# EAGLE design driver (EAGLE 9.6.2)
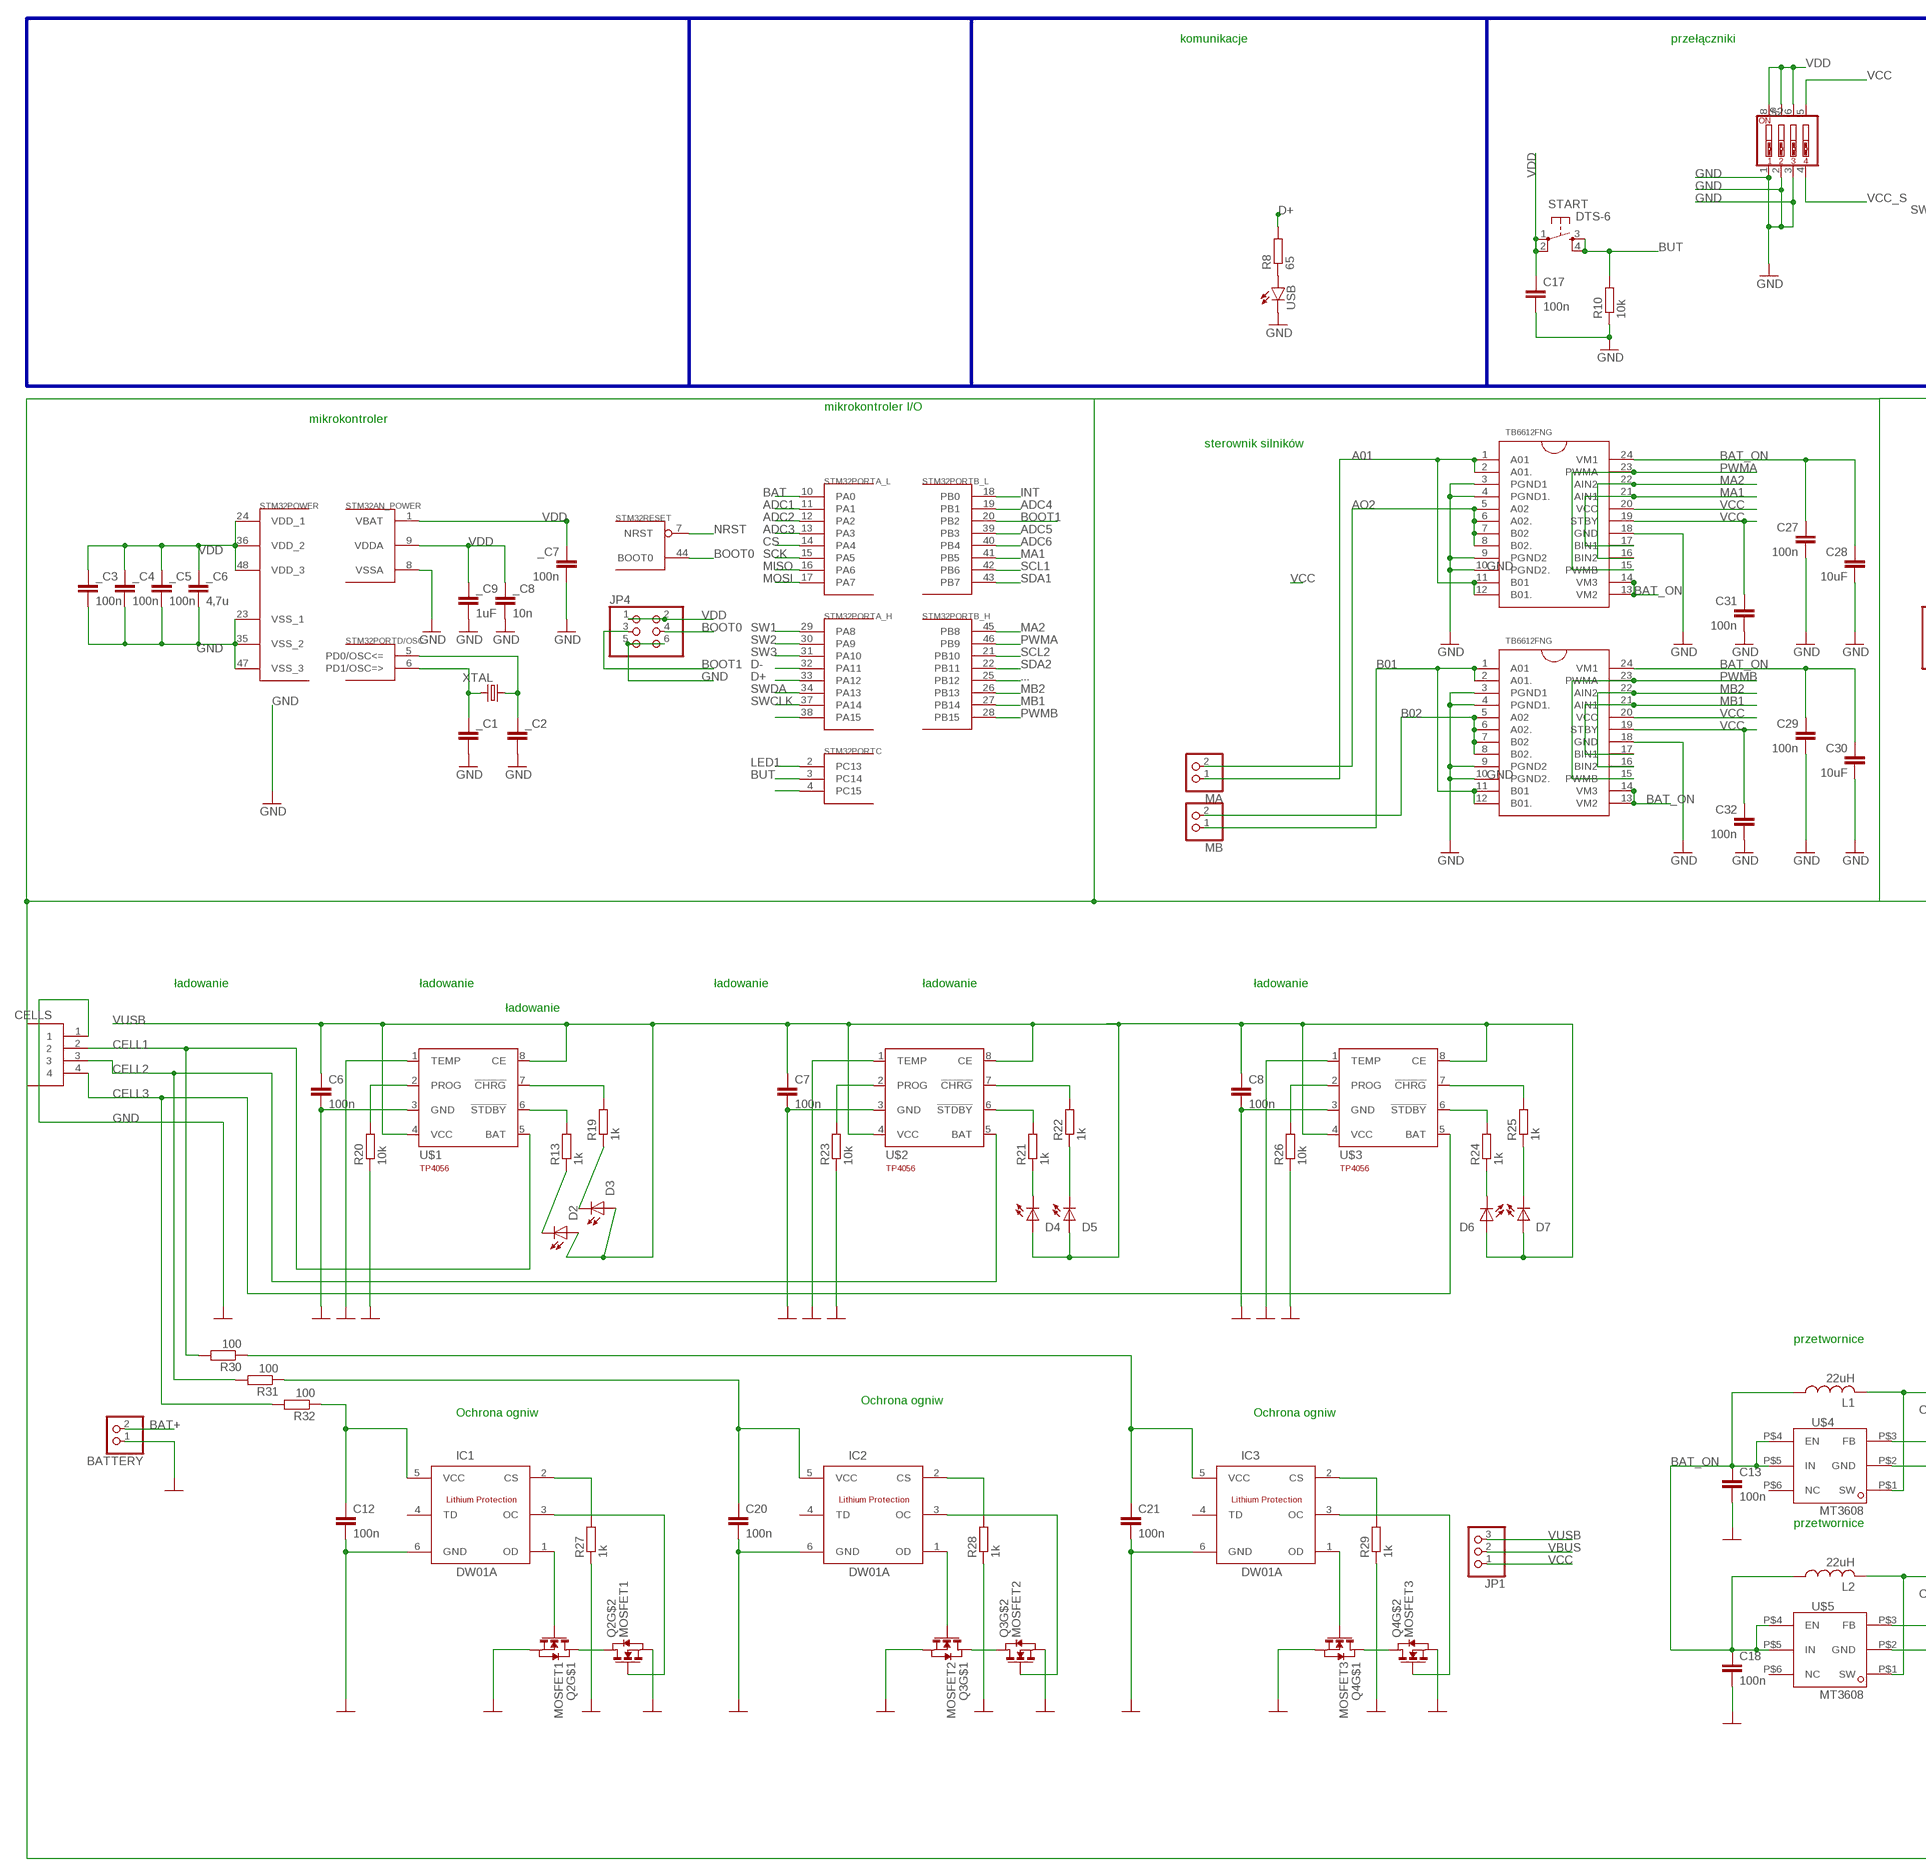
[diagram p0: schematic, sheet 1, part 1 of 2]
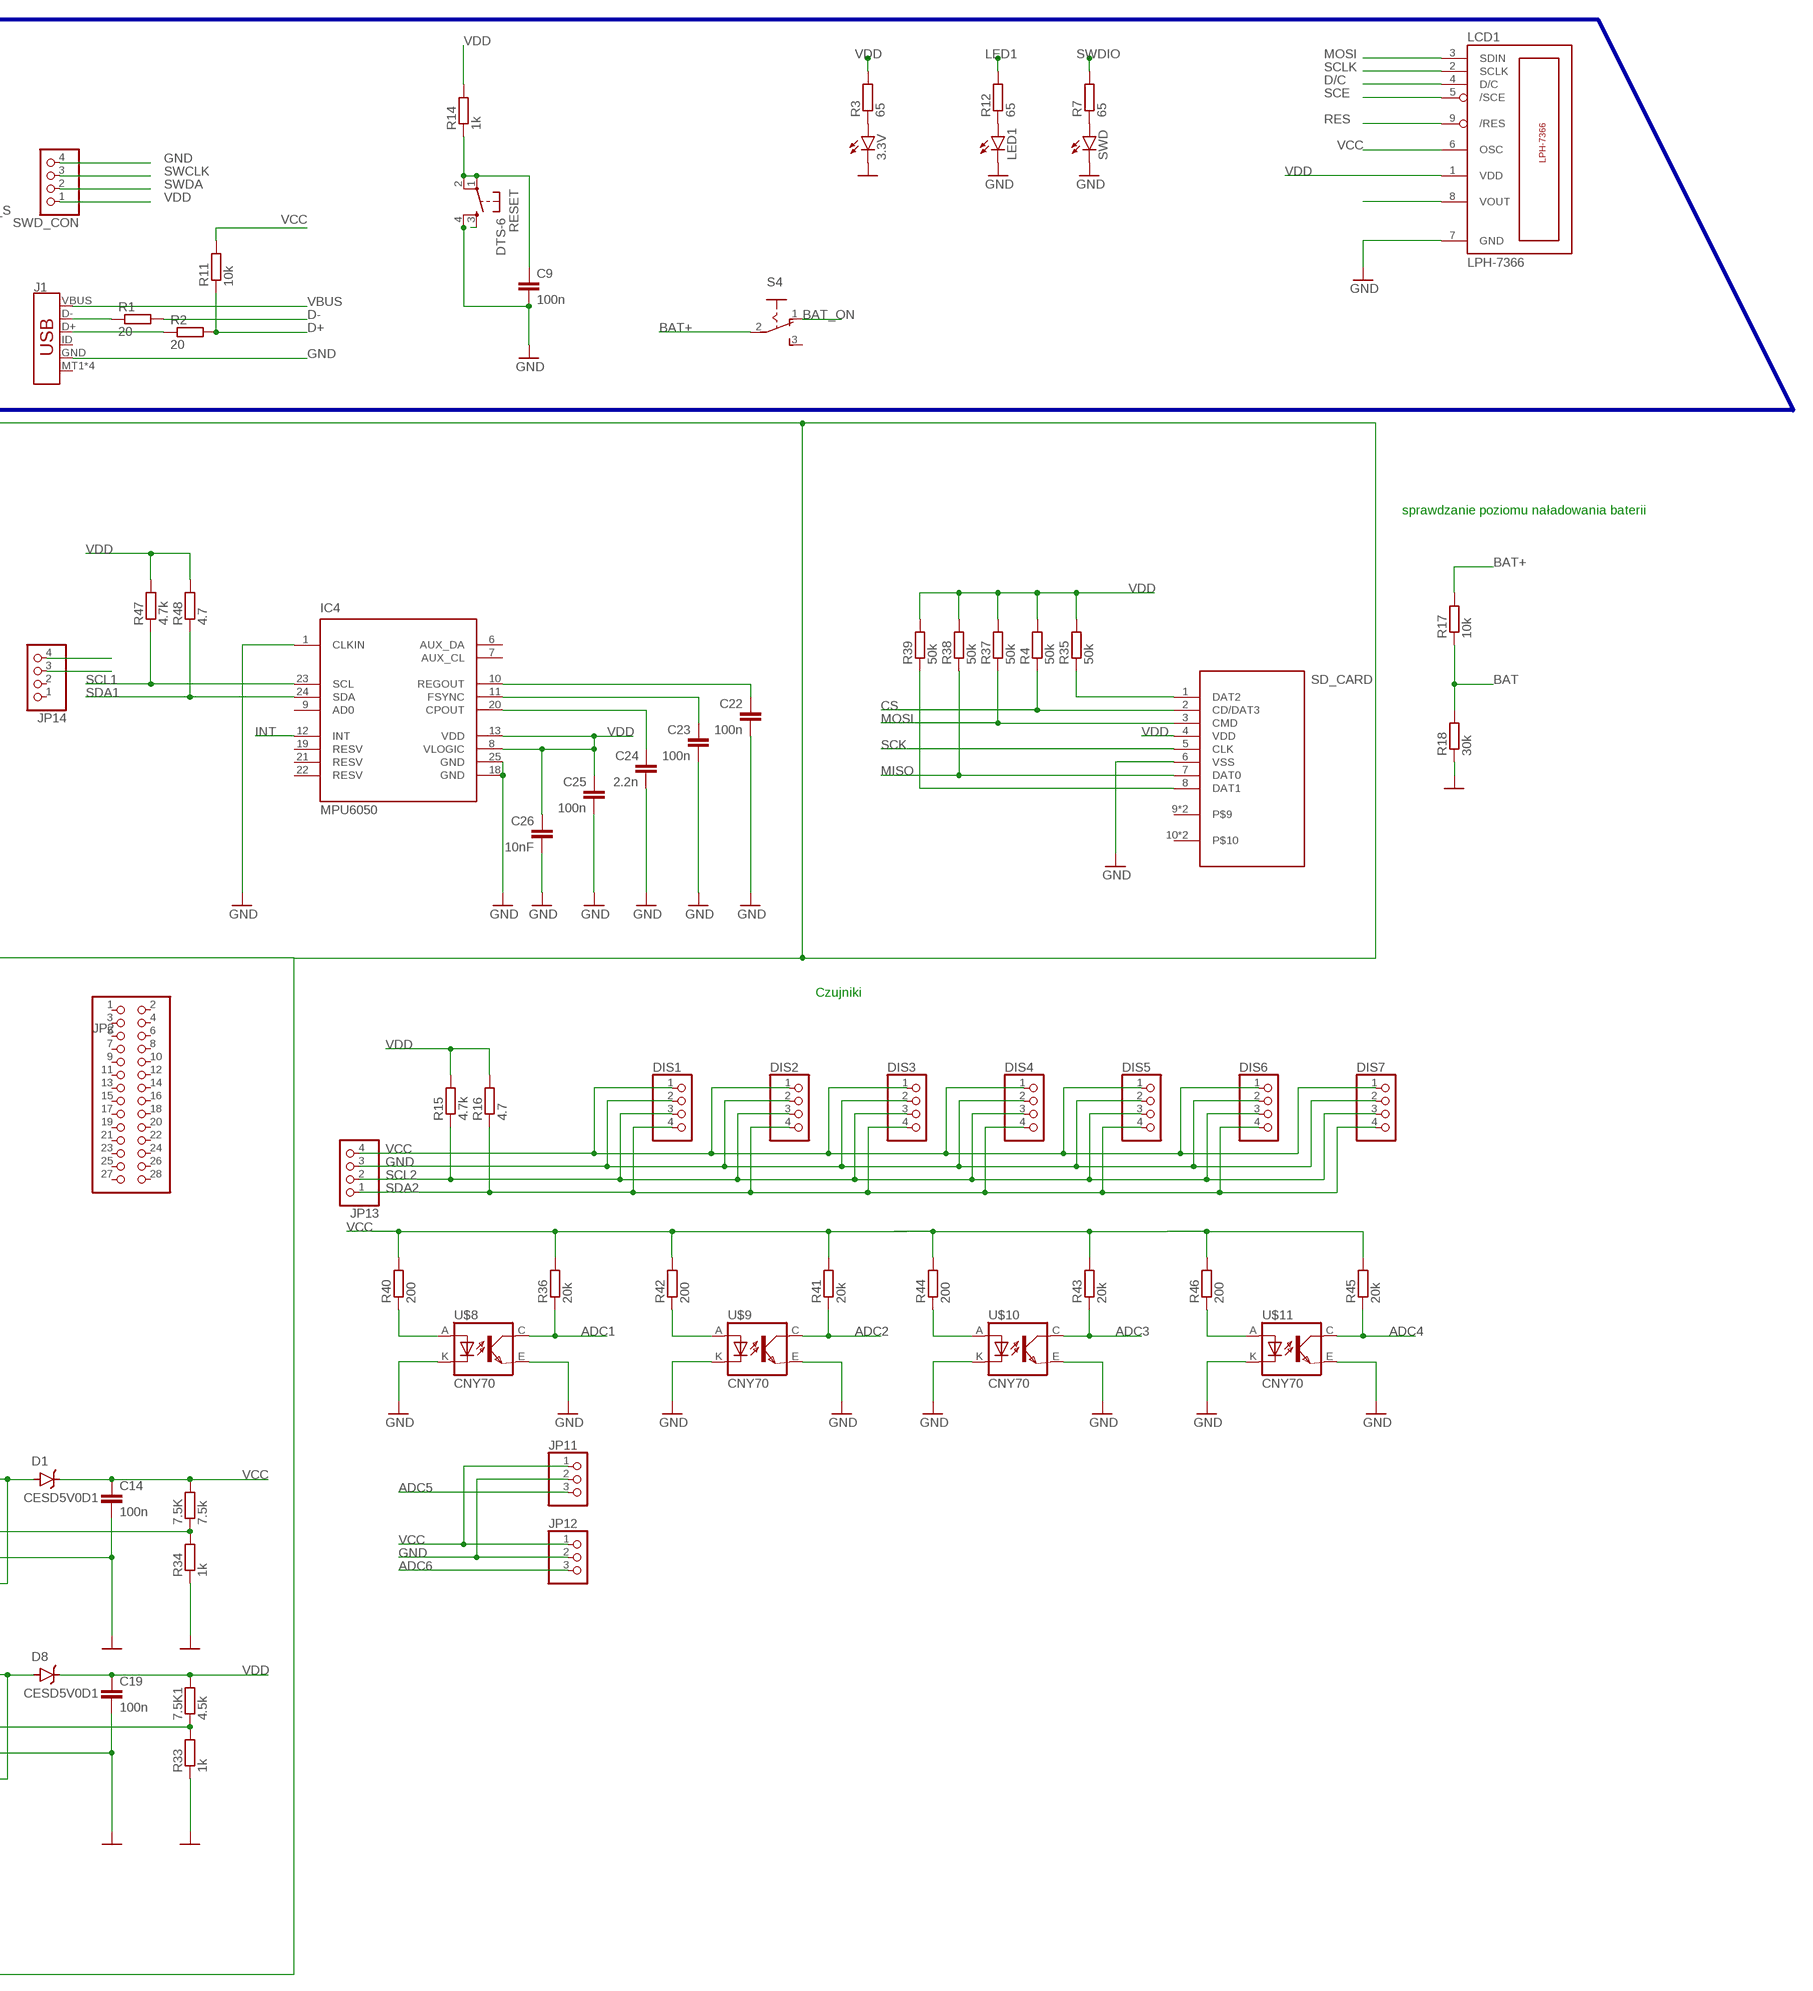
[diagram p1: schematic, sheet 1, part 2 of 2]

## Parts
3.3V  LEDCHIPLED_0805  [CHIPLED_0805]
7.5K  7.5k  R-EU_R0805  [R0805]
7.5K1  4.5k  R-EU_R0805  [R0805]
_C1  C-EUC0603  [C0603]
_C2  C-EUC0603  [C0603]
_C3  100n  C-EUC0603  [C0603]
_C4  100n  C-EUC0603  [C0603]
_C5  100n  C-EUC0603  [C0603]
_C6  4,7u  C-EUC0603  [C0603]
_C7  100n  C-EUC0603  [C0603]
_C8  10n  C-EUC0603  [C0603]
_C9  1uF  C-EUC0603  [C0603]
BATTERY  PINHD-1X2  [1X02]
C6  100n  C-EUC0603  [C0603]
C7  100n  C-EUC0603  [C0603]
C8  100n  C-EUC0603  [C0603]
C9  100n  C-EUC0603  [C0603]
C12  100n  C-EUC0603  [C0603]
C13  100n  C-EUC0603  [C0603]
C14  100n  C-EUC0603  [C0603]
C17  100n  C-EUC0603  [C0603]
C18  100n  C-EUC0603  [C0603]
C19  100n  C-EUC0603  [C0603]
C20  100n  C-EUC0603  [C0603]
C21  100n  C-EUC0603  [C0603]
C22  100n  C-EUC0603  [C0603]
C23  100n  C-EUC0603  [C0603]
C24  2.2n  C-EUC0603  [C0603]
C25  100n  C-EUC0603  [C0603]
C26  10nF  C-EUC0603  [C0603]
C27  100n  C-EUC0603  [C0603]
C28  10uF  C-EUC0603  [C0603]
C29  100n  C-EUC0603  [C0603]
C30  10uF  C-EUC0603  [C0603]
C31  100n  C-EUC0603  [C0603]
C32  100n  C-EUC0603  [C0603]
CELLS  S4B-XH-A(LF)(SN)  [HDR-04/RA]
D1  CESD5V0D1  [SOD-123]
D2  LEDCHIPLED-0603-TTW  [CHIPLED-0603-TTW]
D3  LEDCHIPLED-0603-TTW  [CHIPLED-0603-TTW]
D4  LEDCHIPLED-0603-TTW  [CHIPLED-0603-TTW]
D5  LEDCHIPLED-0603-TTW  [CHIPLED-0603-TTW]
D6  LEDCHIPLED-0603-TTW  [CHIPLED-0603-TTW]
D7  LEDCHIPLED-0603-TTW  [CHIPLED-0603-TTW]
D8  CESD5V0D1  [SOD-123]
DIS1  PINHD-1X4  [1X04]
DIS2  PINHD-1X4  [1X04]
DIS3  PINHD-1X4  [1X04]
DIS4  PINHD-1X4  [1X04]
DIS5  PINHD-1X4  [1X04]
DIS6  PINHD-1X4  [1X04]
DIS7  PINHD-1X4  [1X04]
IC1  DW01A  [SOT23-6]
IC2  DW01A  [SOT23-6]
IC3  DW01A  [SOT23-6]
IC4  MPU6050  [QFN50P400X400X95-25T265X275N]
J1  USB_MICRO-B_SMT  [USB-MICROB]
JP1  PINHD-1X3  [1X03]
JP2  PINHD-2X14  [2X14]
JP4  PINHD-2X3  [2X03]
JP11  PINHD-1X3  [1X03]
JP12  PINHD-1X3  [1X03]
JP13  PINHD-1X4  [1X04]
JP14  PINHD-1X4  [1X04]
L1  22uH  L-USL1812  [L1812]
L2  22uH  L-USL1812  [L1812]
LCD1  LPH-7366  [LPH-7366]
LED1  LEDCHIPLED_0805  [CHIPLED_0805]
MA  PINHD-1X2/90  [1X02/90]
MB  PINHD-1X2/90  [1X02/90]
Q2  MOSFET1  SI1922EDH-T1-GE3  [SOT363]
Q3  MOSFET2  SI1922EDH-T1-GE3  [SOT363]
Q4  MOSFET3  SI1922EDH-T1-GE3  [SOT363]
R1  20  R-EU_R0805  [R0805]
R2  20  R-EU_R0805  [R0805]
R3  65  R-EU_R0805  [R0805]
R4  50k  R-EU_R0805  [R0805]
R7  65  R-EU_R0805  [R0805]
R8  65  R-EU_R0805  [R0805]
R10  10k  R-EU_R0805  [R0805]
R11  10k  R-EU_R0805  [R0805]
R12  65  R-EU_R0805  [R0805]
R13  1k  R-EU_R0805  [R0805]
R14  1k  R-EU_R0805  [R0805]
R15  4.7k  R-EU_R0805  [R0805]
R16  4.7  R-EU_R0805  [R0805]
R17  10k  R-EU_R0805  [R0805]
R18  30k  R-EU_R0805  [R0805]
R19  1k  R-EU_R0805  [R0805]
R20  10k  R-EU_R0805  [R0805]
R21  1k  R-EU_R0805  [R0805]
R22  1k  R-EU_R0805  [R0805]
R23  10k  R-EU_R0805  [R0805]
R24  1k  R-EU_R0805  [R0805]
R25  1k  R-EU_R0805  [R0805]
R26  10k  R-EU_R0805  [R0805]
R27  1k  R-EU_R0805  [R0805]
R28  1k  R-EU_R0805  [R0805]
R29  1k  R-EU_R0805  [R0805]
R30  100  R-EU_R0805  [R0805]
R31  100  R-EU_R0805  [R0805]
R32  100  R-EU_R0805  [R0805]
R33  1k  R-EU_R0805  [R0805]
R34  1k  R-EU_R0805  [R0805]
R35  50k  R-EU_R0805  [R0805]
R36  20k  R-EU_R0805  [R0805]
R37  50k  R-EU_R0805  [R0805]
R38  50k  R-EU_R0805  [R0805]
R39  50k  R-EU_R0805  [R0805]
R40  200  R-EU_R0805  [R0805]
R41  20k  R-EU_R0805  [R0805]
R42  200  R-EU_R0805  [R0805]
R43  20k  R-EU_R0805  [R0805]
R44  200  R-EU_R0805  [R0805]
R45  20k  R-EU_R0805  [R0805]
R46  200  R-EU_R0805  [R0805]
R47  4.7k  R-EU_R0805  [R0805]
R48  4.7  R-EU_R0805  [R0805]
RESET  DTS-6  [DTS-6]
S2  SW_DIP-4  [EDG-04]
S4  255SB  [255SB]
SD_CARD  693071010811  [693071010811]
START  DTS-6  [DTS-6]
STM32  STM32F10XCXT6  [TQFP48]
SWD  LEDCHIPLED_0805  [CHIPLED_0805]
SWD_CON  PINHD-1X4  [1X04]
U$1  TP4056  [SOT23-8]
U$2  TP4056  [SOT23-8]
U$3  TP4056  [SOT23-8]
U$4  MT3608SOT23-6  [SOT23-6]
U$5  MT3608SOT23-6  [SOT23-6]
U$6  TB6612FNG  [SSOP24]
U$7  TB6612FNG  [SSOP24]
U$8  CNY70  [4]
U$9  CNY70  [4]
U$10  CNY70  [4]
U$11  CNY70  [4]
USB  LEDCHIPLED_0805  [CHIPLED_0805]
XTAL  KX-7  [3.2X2.5_KX-7]

## Nets
...: STM32.25(PORTB_H:PB12)
A01: MA.1 U$6.1(A01) U$6.2(A01.) U$6.11(B01) U$6.12(B01.)
ADC1: R36.1 STM32.11(PORTA_L:PA1) U$8.C(COL)
ADC2: R41.1 STM32.12(PORTA_L:PA2) U$9.C(COL)
ADC3: R43.1 STM32.13(PORTA_L:PA3) U$10.C(COL)
ADC4: R45.1 STM32.19(PORTB_L:PB1) U$11.C(COL)
ADC5: JP11.3 STM32.39(PORTB_L:PB3)
ADC6: JP12.3 STM32.40(PORTB_L:PB4)
AO2: MA.2 U$6.5(A02) U$6.6(A02.) U$6.7(B02) U$6.8(B02.)
B01: MB.1 U$7.1(A01) U$7.2(A01.) U$7.11(B01) U$7.12(B01.)
B02: MB.2 U$7.5(A02) U$7.6(A02.) U$7.7(B02) U$7.8(B02.)
BAT: R17.1 R18.2 STM32.10(PORTA_L:PA0)
BAT+: BATTERY.2 R17.2 S4.2(P)
BAT_ON: C13.1 C18.1 C27.1 C28.1 C29.1 C30.1 L1.1 L2.1 S4.1(O) U$4.P$4(EN) U$4.P$5(IN) U$5.P$4(EN) U$5.P$5(IN) U$6.13(VM2) U$6.14(VM3) U$6.24(VM1) U$7.13(VM2) U$7.14(VM3) U$7.24(VM1)
BOOT0: JP4.4 STM32.44(RESET:BOOT0)
BOOT1: JP4.3 STM32.20(PORTB_L:PB2)
BUT: R10.2 START.3 START.4 STM32.3(PORTC:PC14)
CELL1: CELLS.2 R30.2 U$1.5(BAT)
CELL2: CELLS.3 R31.2 U$2.5(BAT)
CELL3: CELLS.4 R32.2 U$3.5(BAT)
CS: R4.1 SD_CARD.2(CD/DAT3) STM32.14(PORTA_L:PA4)
D+: R2.2 R8.2 R11.1 STM32.33(PORTA_H:PA12)
D-: R1.2 STM32.32(PORTA_H:PA11)
D/C: LCD1.4(D/C)
GND: 3.3V.C _C1.2 _C2.2 _C3.2 _C4.2 _C5.2 _C6.2 _C7.2 _C8.2 _C9.2 BATTERY.1 C6.2 C7.2 C8.2 C9.2 C12.2 C13.2 C14.2 C17.2 C18.2 C19.2 C20.2 C21.2 C22.2 C23.2 C24.2 C25.2 C26.2 C27.2 C28.2 C29.2 C30.2 C31.2 C32.2 CELLS.1 DIS1.2 DIS2.2 DIS3.2 DIS4.2 DIS5.2 DIS6.2 DIS7.2 IC1.6(GND) IC2.6(GND) IC3.6(GND) IC4.1(CLKIN) IC4.18(GND) IC4.25(GND) J1.GND JP4.5 JP4.6 JP11.2 JP12.2 JP13.3 LCD1.7(GND) LED1.C Q2.1(S) Q2.4(S) Q3.1(S) Q3.4(S) Q4.1(S) Q4.4(S) R10.1 R18.1 R20.1 R23.1 R26.1 R27.1 R28.1 R29.1 R33.1 R34.1 RESET.4 S2.1 S2.2 S2.3 SD_CARD.6(VSS) STM32.8(AN_POWER:VSSA) STM32.23(POWER:VSS_1) STM32.35(POWER:VSS_2) STM32.47(POWER:VSS_3) SWD.C SWD_CON.4 U$1.1(TEMP) U$1.3(GND) U$2.1(TEMP) U$2.3(GND) U$3.1(TEMP) U$3.3(GND) U$4.P$2(GND) U$5.P$2(GND) U$6.3(PGND1) U$6.4(PGND1.) U$6.9(PGND2) U$6.10(PGND2.) U$6.18(GND) U$7.3(PGND1) U$7.4(PGND1.) U$7.9(PGND2) U$7.10(PGND2.) U$7.18(GND) U$8.E(EMI) U$8.K(C) U$9.E(EMI) U$9.K(C) U$10.E(EMI) U$10.K(C) U$11.E(EMI) U$11.K(C) USB.C
INT: IC4.12(INT) STM32.18(PORTB_L:PB0)
LED1: R12.2 STM32.2(PORTC:PC13)
MA1: STM32.41(PORTB_L:PB5) U$6.17(BIN1) U$6.21(AIN1)
MA2: STM32.45(PORTB_H:PB8) U$6.16(BIN2) U$6.22(AIN2)
MB1: STM32.27(PORTB_H:PB14) U$7.17(BIN1) U$7.21(AIN1)
MB2: STM32.26(PORTB_H:PB13) U$7.16(BIN2) U$7.22(AIN2)
MISO: R38.1 SD_CARD.7(DAT0) STM32.16(PORTA_L:PA6)
MOSI: LCD1.3(SDIN) R37.1 SD_CARD.3(CMD) STM32.17(PORTA_L:PA7)
N$1: R40.1 U$8.A
N$2: JP14.4
N$3: _C2.1 STM32.5(PORTD/OSC:PD0/OSC<=) XTAL.1
N$4: _C1.1 STM32.6(PORTD/OSC:PD1/OSC=>) XTAL.3
N$5: RESET.3
N$6: J1.D+ R2.1
N$7: J1.D- R1.1
N$8: R22.2 U$2.7(!CHRG)
N$9: R13.2 U$1.6(!STDBY)
N$10: 3.3V.A R3.1
N$11: R7.1 SWD.A
N$12: D2.C@1(C) R13.1
N$13: R19.2 U$1.7(!CHRG)
N$14: D3.C@1(C) R19.1
N$15: R20.2 U$1.2(PROG)
N$16: R21.2 U$2.6(!STDBY)
N$17: JP14.3
N$18: D4.C@1(C) R21.1
N$19: D5.C@1(C) R22.1
N$20: R23.2 U$2.2(PROG)
N$21: LCD1.8(VOUT)
N$22: R25.2 U$3.7(!CHRG)
N$23: R24.2 U$3.6(!STDBY)
N$24: D6.C@1(C) R24.1
N$25: D7.C@1(C) R25.1
N$26: R26.2 U$3.2(PROG)
N$27: IC1.1(OD) Q2.2(G)
N$28: IC1.3(OC) Q2.5(G)
N$29: C12.1 IC1.5(VCC) R32.1
N$30: IC1.2(CS) R27.2
N$31: Q2.3(D) Q2.6(D)
N$32: IC2.2(CS) R28.2
N$33: C20.1 IC2.5(VCC) R31.1
N$34: IC2.1(OD) Q3.2(G)
N$35: IC2.3(OC) Q3.5(G)
N$36: Q3.3(D) Q3.6(D)
N$37: IC3.2(CS) R29.2
N$38: C21.1 IC3.5(VCC) R30.1
N$39: IC3.1(OD) Q4.2(G)
N$40: IC3.3(OC) Q4.5(G)
N$41: Q4.3(D) Q4.6(D)
N$42: C22.1 IC4.10(REGOUT)
N$43: C23.1
N$44: IC4.11(FSYNC)
N$45: C24.1 IC4.20(CPOUT)
N$47: D1.A L1.2 U$4.P$1(SW)
N$49: D8.A L2.2 U$5.P$1(SW)
N$50: 7.5K1.1 R33.2 U$5.P$3(FB)
N$51: 7.5K.1 R34.2 U$4.P$3(FB)
N$54: LED1.A R12.1
N$55: R8.1 USB.A
N$56: R42.1 U$9.A
N$61: R35.1 SD_CARD.1(DAT2)
N$62: R44.1 U$10.A
N$63: R39.1 SD_CARD.8(DAT1)
N$65: R43.2 R44.2
N$66: R46.1 U$11.A
N$68: R45.2 R46.2
NRST: C9.1 R14.1 RESET.1 RESET.2 STM32.7(RESET:NRST)
PC15: STM32.4(PORTC:PC15)
PWMA: STM32.46(PORTB_H:PB9) U$6.15(PWMB) U$6.23(PWMA)
PWMB: STM32.28(PORTB_H:PB15) U$7.15(PWMB) U$7.23(PWMA)
RES: LCD1.9(/RES)
SCE: LCD1.5(/SCE)
SCK: SD_CARD.5(CLK) STM32.15(PORTA_L:PA5)
SCL1: IC4.23(SCL) R47.1 STM32.42(PORTB_L:PB6)
SCL2: DIS1.3 DIS2.3 DIS3.3 DIS4.3 DIS5.3 DIS6.3 DIS7.3 JP13.2 R15.1 STM32.21(PORTB_H:PB10)
SCLK: LCD1.2(SCLK)
SDA1: IC4.24(SDA) R48.1 STM32.43(PORTB_L:PB7)
SDA2: DIS1.4 DIS2.4 DIS3.4 DIS4.4 DIS5.4 DIS6.4 DIS7.4 JP13.1 R16.1 STM32.22(PORTB_H:PB11)
SW1: STM32.29(PORTA_H:PA8)
SW2: STM32.30(PORTA_H:PA9)
SW3: STM32.31(PORTA_H:PA10)
SWCLK: STM32.37(PORTA_H:PA14) SWD_CON.3
SWDA: STM32.34(PORTA_H:PA13) SWD_CON.2
SWDIO: R7.2
TDI: STM32.38(PORTA_H:PA15)
VBUS: J1.VBUS JP1.2
VCC: 7.5K.2 C14.1 C31.1 C32.1 D1.C DIS1.1 DIS2.1 DIS3.1 DIS4.1 DIS5.1 DIS6.1 DIS7.1 JP1.1 JP11.1 JP12.1 JP13.4 LCD1.6(OSC) R11.2 R36.2 R40.2 R41.2 R42.2 S2.5 U$6.19(STBY) U$6.20(VCC) U$7.19(STBY) U$7.20(VCC)
VCC_S: S2.4
VDD: 7.5K1.2 _C3.1 _C4.1 _C5.1 _C6.1 _C7.1 _C8.1 _C9.1 C17.1 C19.1 C25.1 C26.1 D8.C IC4.8(VLOGIC) IC4.13(VDD) JP4.1 JP4.2 LCD1.1(VDD) R3.2 R4.2 R14.2 R15.2 R16.2 R35.2 R37.2 R38.2 R39.2 R47.2 R48.2 S2.6 S2.7 S2.8 SD_CARD.4(VDD) START.1 START.2 STM32.1(AN_POWER:VBAT) STM32.9(AN_POWER:VDDA) STM32.24(POWER:VDD_1) STM32.36(POWER:VDD_2) STM32.48(POWER:VDD_3) SWD_CON.1
VUSB: C6.1 C7.1 C8.1 D2.A@1(A) D3.A@1(A) D4.A@1(A) D5.A@1(A) D6.A@1(A) D7.A@1(A) JP1.3 U$1.4(VCC) U$1.8(CE) U$2.4(VCC) U$2.8(CE) U$3.4(VCC) U$3.8(CE)
Unconnected: IC1.4(TD) IC2.4(TD) IC3.4(TD) IC4.2(NC) IC4.3(NC) IC4.4(NC) IC4.5(NC) IC4.6(AUX_DA) IC4.7(AUX_CL) IC4.9(AD0) IC4.14(NC) IC4.15(NC) IC4.16(NC) IC4.17(NC) IC4.19(RESV) IC4.21(RESV) IC4.22(RESV) J1.ID J1.MT1(SHIELD) J1.MT2(SHIELD) J1.P$1(SHIELD) J1.P$2(SHIELD) JP2.1 JP2.2 JP2.3 JP2.4 JP2.5 JP2.6 JP2.7 JP2.8 JP2.9 JP2.10 JP2.11 JP2.12 JP2.13 JP2.14 JP2.15 JP2.16 JP2.17 JP2.18 JP2.19 JP2.20 JP2.21 JP2.22 JP2.23 JP2.24 JP2.25 JP2.26 JP2.27 JP2.28 JP14.1 JP14.2 S4.3(S) SD_CARD.9 SD_CARD.9-1 SD_CARD.10 SD_CARD.10-1 U$4.P$6(NC) U$5.P$6(NC)

## Buses
B$1

## Notes on the sheet
- komunikacje | przełączniki
- mikrokontroler I/O
- mikrokontroler
- sterownik silników
- sprawdzanie poziomu naładowania baterii
- Czujniki
- ładowanie | ładowanie | ładowanie | ładowanie | ładowanie
- ładowanie
- przetwornice
- Ochrona ogniw
- Ochrona ogniw | Ochrona ogniw
- przetwornice

## Library data of the parts
3.3V LED1 SWD USB = led:LED: LED; SPICEPREFIX: D
7.5K 7.5K1 R1-R4 R7 R8 R10-R48 = rcl:R-EU_: RESISTOR, European symbol; SPICEPREFIX: R
_C1-_C9 C6-C9 C12-C14 C17-C32 = rcl:C-EU: CAPACITOR, European symbol; SPICEPREFIX: C
BATTERY MA MB = pinhead:PINHD-1X2: PIN HEADER
CELLS = Connectors:S4B-XH-A(LF)(SN): CONN HEADER R/A 4POS 2.5MM Manufacturer's datasheet <http://www.jst-mfg.com/product/pdf/eng/eXH.pdf>; CREATED_BY: PCBLayout.com; DIGIKEY_PART_NUMBER: 455-2243-ND; MANUFACTURER: JST Sales America Inc.; MPN: S4B-XH-A(LF)(SN)
D1 D8 = Diodes:CESD5V0D1: SOD-123 Plastic-Encapsulate Diodes Uni-direction ESD Protection Diode Manufacturer's datasheet <https://seeeddoc.github.io/Open_parts_library/res/304060001.pdf>; CREATED_BY: PCBLayout.com; MANUFACTURER: JCET; MPN: CESD5V0D1; PACKAGE: SOD-123
D2-D7 = adafruit:LED: LED
DIS1-DIS7 JP13 JP14 SWD_CON = pinhead:PINHD-1X4: PIN HEADER
IC1-IC3 = DW01A:DW01A; AVAILABILITY: Unavailable; DESCRIPTION: One Cell Lithium-ion/Polymer Battery Protection IC; MF: Fortune Semiconductor; MP: DW01A; PACKAGE: SOT-23-6 Fortune Semiconductor; PRICE: None
IC4 = invensense:MPU6050: The triple-axis MEMS gyroscope
J1 = SparkFun-Connectors:USB_MICRO-B: USB Type Micro-B Connector Male/female and PTH/SMT variants SparkFun Products: SparkFun microB USB Breakout <https://www.sparkfun.com/products/12035> SparkFun USB microB Plug Breakout <https://www.sparkfun.com/products/10031> SparkFun ESP8266 Thing <https://www.sparkfun.com/products/13231>; PROD_ID: CONN-09505; SF_ID: PRT-08533
JP1 JP11 JP12 = pinhead:PINHD-1X3: PIN HEADER
JP2 = pinhead:PINHD-2X14: PIN HEADER
JP4 = pinhead:PINHD-2X3: PIN HEADER
L1 L2 = rcl:L-US: INDUCTOR, American symbol; SPICEPREFIX: L
LCD1 = lph-7366 (1):LPH-7366
Q2-Q4 = fets:SI1922EDH-T1-GE3: MOSFET 2N-CH 20V 1.3A SOT-363; DIGIKEY: SI1922EDH-T1-GE3CT-ND; MANUFACTURER: Vishay Siliconix; MPN: SI1922EDH-T1-GE3
RESET START = switch-tact:DTS-6
S2 = special:SW_DIP-4: DIP SWITCH
S4 = switch:255SB: SLIDING SWITCH Distributor Buerklin, 11G810
SD_CARD = Wurth_Elektronik_Electromechanic_Input-Output_Connectors_rev16a:693071010811: WR-CRD MICRO SD CARD CONNECTOR PUSH & PUSH WITH CARD DETECTION 8PINS=>Code : Con_I-O_COM_CRD_SD_Micro_693071010811 <http://katalog.we-online.de/media/images/eican/Con_I-O_COM_CRD_SD_Micro_693071010811_pf2.jpg> Details see: http://katalog.we-online.de/en/em/693_071_010_811 Created 2014-07-09, Karrer Zheng 2014 (C) Würth Elektronik
STM32 = stm32:STM32F10XCXT6: ST STM32F101/103 48pin LQFP
U$1-U$3 = TP4056:TP4056: TP4056 Data sheet <http://goo.gl/J7k8TF> Dave.Calaway Eagle Library <https://goo.gl/Muy1Tr>
U$4 U$5 = MT3608:MT3608: MT3608 High Efficiency 1.2MHz 2A Step Up Converter BY: Rangana Tennakoon
U$6 U$7 = TB6612FNG:TB6612FNG
U$8-U$11 = cny70:CNY70
XTAL = crystal-geyer_V1_0:KX: Quartz Crystals (MHz) SMD: KX - Serie Model Size l/w/h [mm] Frequency Range Frequency Stability Temp. Range [°C] Load Capacitance AECQ 200 availabel Datasheet KX-4 KX-5 KX-6 KX-7 KX-9A KX-9B KX-12A KX-12B KX-13 KX-20 KX-K KX-KS 1.6/1.2/0.3 2.0/1.6/0.45 2.5/2.0/0.55 3.2/2.5/0.8 5.0/3.2/1.0 5.0/3.2/1.1 6.0/3.5/1.1 6.0/3.5/1.0 7.0/5.0 /1.3 11.6/5.5/1.6 12.3/4.5/4.2 12.3/4.5/3.2 24.0 ~ 80.0 MHz 16.0 ~ 80.0 MHz 12.0 ~ 80.0 MHz 8.0 ~ 60.0 MHz 7,68 ~ 300,0 MHz 8,0 ~ 50,0 MHz 8,0 ~ 150,0 MHz 8,0 ~ 50,0 MHz 6,0 ~ 160,0 MHz 3,579 ~ 25,0 MHz 3,579 ~ 70,0 MHz 3,579 ~ 70,0 MHz ±10 … ±50ppm ±10 … ±50ppm ±10 … ±50ppm ±10 … ±50ppm ±10 … ±50ppm ±10 … ±50ppm ±10 … ±50ppm ±10 … ±50ppm ±10 … ±50ppm ±50ppm ±10 … ±50ppm ±10 … ±50ppm (*) -40°C …+85°C (*) -40°C …+125°C (*) -40°C …+125°C (*) -40°C …+125°C (*) -40°C …+105°C (*) -40°C …+105°C (*) -40°C …+125°C (*) -40°C …+105°C (*) -40°C …+105°C (*) -40°C …+105°C (*) -40°C …+85°C (*) -40°C …+85°C 8, 8…16 8, 8…16 10, 8…16 12, 7…20 16, 10…20 16, 10…20 16, 10…20 16, 12…20 16, 12…20 16, 12…20 16, 12…30 16, 12…30 - yes yes yes - - - - - - - - KX-4.pdf <http://www.geyer-electronic.de/uploads/tx_userartikelfrequenz/GEYER-KX-4.pdf> KX-5.pdf <http://www.geyer-electronic.de/uploads/tx_userartikelfrequenz/GEYER-KX-5.pdf> KX-6.pdf <http://www.geyer-electronic.de/uploads/tx_userartikelfrequenz/GEYER-KX-6.pdf> KX-7.pdf <http://www.geyer-electronic.de/uploads/tx_userartikelfrequenz/GEYER-KX-7.pdf> KX-9A.pdf <http://www.geyer-electronic.de/uploads/tx_userartikelfrequenz/GEYER-KX-9A.pdf> KX-9B.pdf <http://www.geyer-electronic.de/uploads/tx_userartikelfrequenz/GEYER-KX-9B.pdf> KX-12A.pdf <http://www.geyer-electronic.de/uploads/tx_userartikelfrequenz/GEYER-KX-12A.pdf> KX-12B.pdf <http://www.geyer-electronic.de/uploads/tx_userartikelfrequenz/GEYER-KX-12B.pdf> KX-13.pdf <http://www.geyer-electronic.de/uploads/tx_userartikelfrequenz/GEYER-KX-13.pdf> KX-20.pdf <http://www.geyer-electronic.de/uploads/tx_userartikelfrequenz/GEYER-KX-20.pdf> KX-K.pdf <http://www.geyer-electronic.de/uploads/tx_userartikelfrequenz/GEYER-KX-K.pdf> KX-KS.pdf <http://www.geyer-electronic.de/uploads/tx_userartikelfrequenz/GEYER-KX-KS.pdf> <http://www.geyer-electronic.de/fileadmin/template/img/logo-geyer-electronic.png> Details see: http://www.geyer-electronic.de/Frequenz-Produkte.9.0.html Created 2016-06-07, Hans Locher 2016 (C) Geyer Quartz Technology KX4,KX5,KX6,KX7,KX9A,KX9B,KX12A,KX12B,KX13,KX20,KXK,KXKS;1612;2016;2520;3225;5032;6035;7050;11655;12345;1,6x1,2;2,0x1,6;2,5x2,0;3,2x2,5;5,0x3,2;6,0x3,5;7,0x5,0;11,6x5,5;12,3x4,5;12,3x4,5;1.6x1.2;2.0x1.6;2.5x2.0;3.2x2.5;5.0x3.2;6.0x3.5;7.0x5.0;11.6x5.5;12.3x4.5;12.3x4.5;

## Board
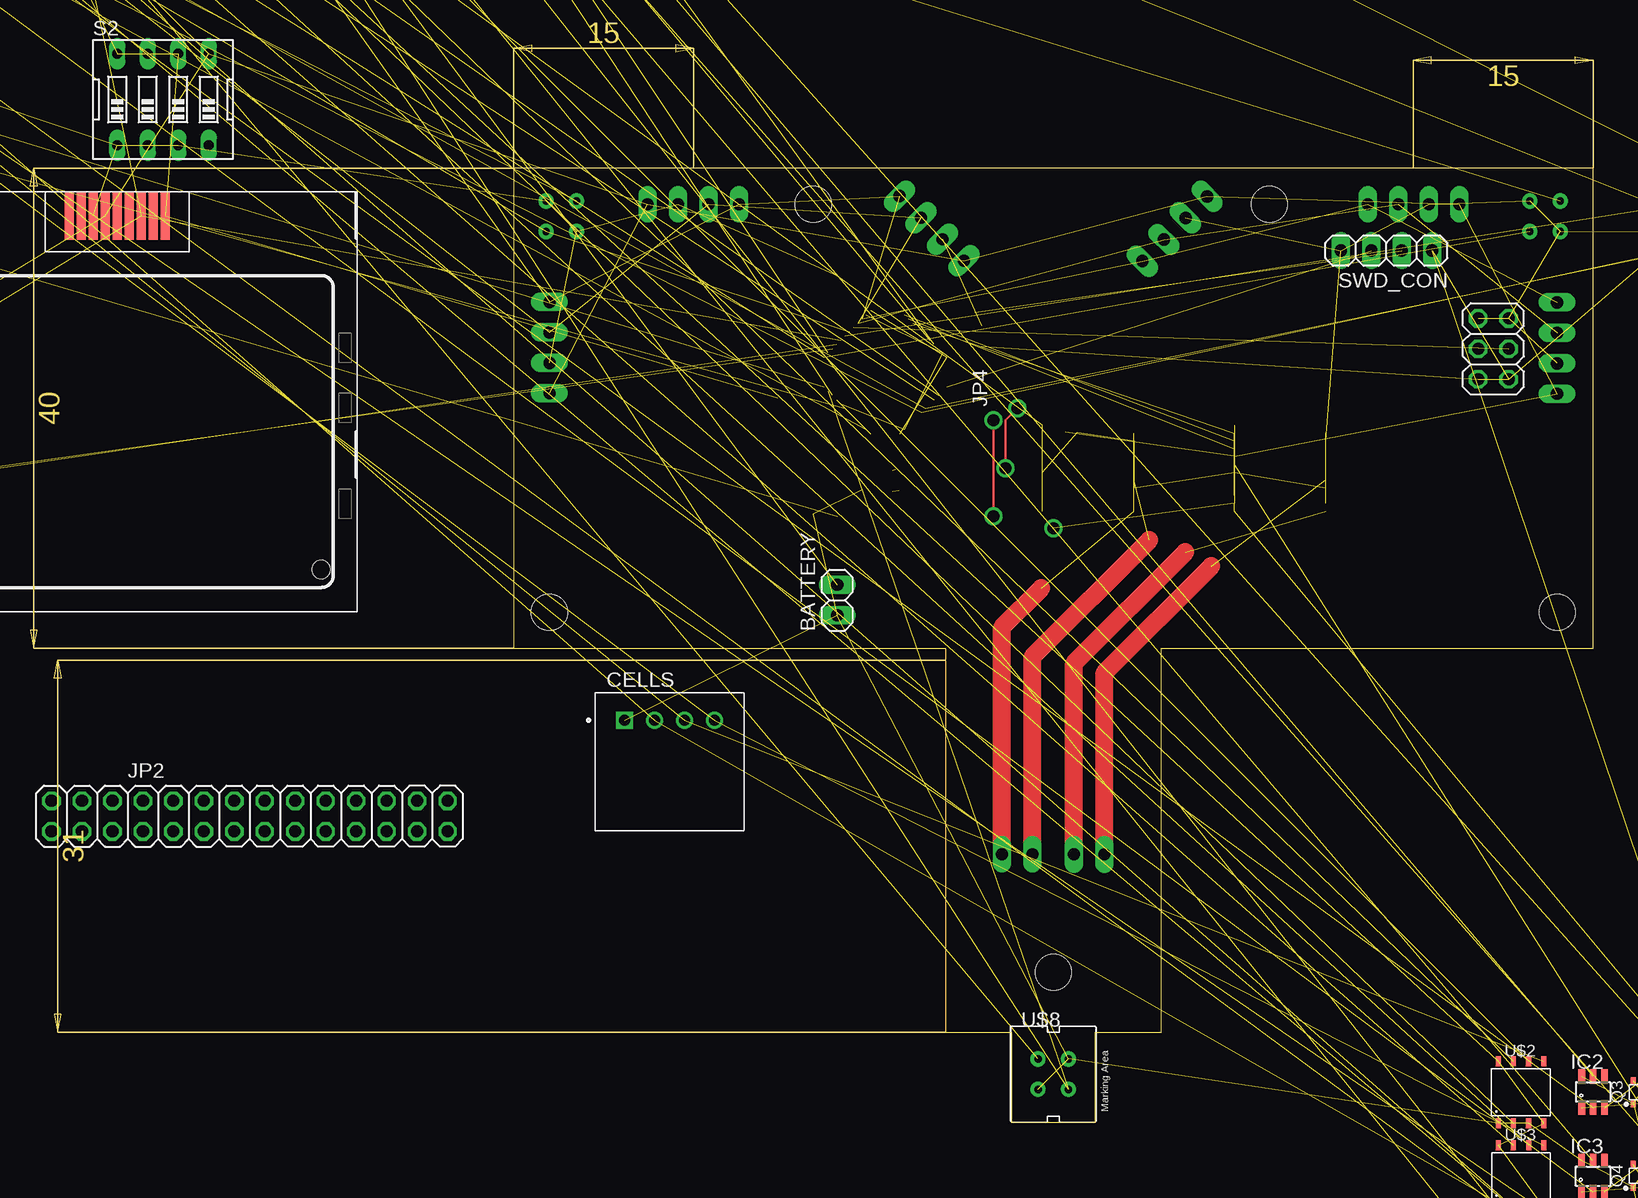
[diagram p2: board, top side]
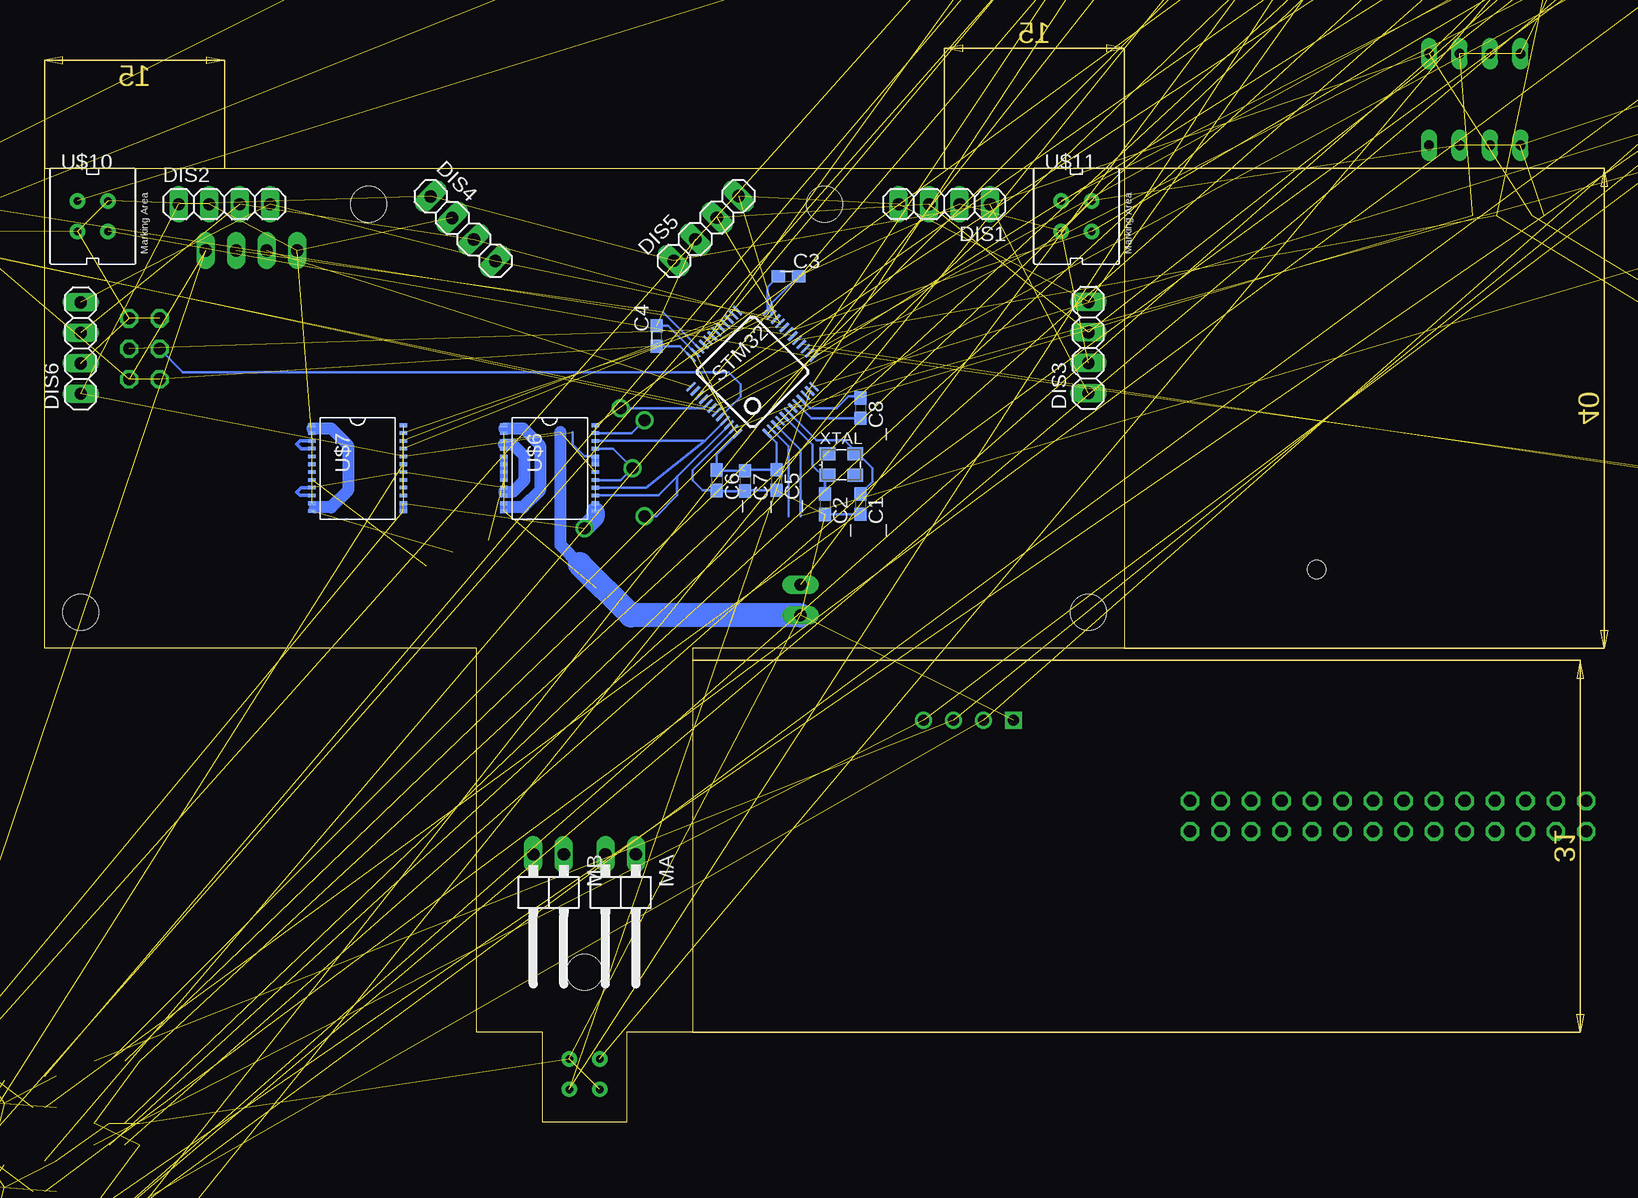
[diagram p3: board, bottom side, seen from below]

Size 90 x 79.5 mm. Coordinates in mm from the lower left corner, seen from the top.
Outline: 0,39.5 36,39.5 36,7.5 41.51,7.5 41.51,0 48.5,0 48.5,7.5 54,7.5 54,39.5 90,39.5 90,79.5 62,79.5 30,79.5 0,79.5 0,39.5
Copper layers (1*16): Top 0.035mm / dielectric 0.15mm / Bottom 0.035mm
Design rules "default": minimum track width 6mil, minimum drill 0.35mm, track to track 6mil, track to pad 6mil, pad to pad 6mil, via to via 6mil, smd to smd 6mil, copper to edge 40mil, drill to drill 6mil, minimum pad ring 10mil, minimum via ring 8mil, stop-mask expansion 4mil, vias tented up to drill 0mil, thermal gap 10mil
Holes 3 mm at 45,12.5 3,42.5 87,42.5 25,76.5 63,76.5

### Footprints (pad centres in the part's own frame; a part is rotated, then mirrored left to right if it is on the bottom)
CHIPLED_0805 = smd 1.2 x 1.2: A 0,-1.05; C 0,1.05
R0805 = smd 1.3 x 1.5: 1 -0.95,0; 2 0.95,0
C0603 = smd 1.1 x 1: 1 -0.85,0; 2 0.85,0
1X02 = drill 1.016 long: 1 -1.27,0; 2 1.27,0
HDR-04/RA = drill 0.9 square: 1 -3.75,0 | drill 0.9: 2 -1.25,0; 3 1.25,0; 4 3.75,0
SOD-123 = smd 1.02 x 0.86: A 1.68,0; C -1.68,0
CHIPLED-0603-TTW = smd 0.8 x 0.5: A 0,-0.875; C 0,0.875 | smd 0.35 x 0.35: A@1 0,-0.5; C@1 0,0.5
1X04 = drill 1.016 long: 1 -3.81,0; 2 -1.27,0; 3 1.27,0; 4 3.81,0
SOT23-6 = smd 0.55 x 1.2: 1 -0.95,-1.3; 2 0,-1.3; 3 0.95,-1.3; 4 0.95,1.3; 5 0,1.3; 6 -0.95,1.3
QFN50P400X400X95-25T265X275N = smd 0.26 x 0.79: 1 -1.25,-1.97; 2 -0.75,-1.97; 3 -0.25,-1.97; 4 0.25,-1.97; 5 0.75,-1.97; 6 1.25,-1.97; 13 1.25,1.97; 14 0.75,1.97; 15 0.25,1.97; 16 -0.25,1.97; 17 -0.75,1.97; 18 -1.25,1.97 | smd 0.79 x 0.26: 7 1.97,-1.25; 8 1.97,-0.75; 9 1.97,-0.25; 10 1.97,0.25; 11 1.97,0.75; 12 1.97,1.25; 19 -1.97,1.25; 20 -1.97,0.75; 21 -1.97,0.25; 22 -1.97,-0.25; 23 -1.97,-0.75; 24 -1.97,-1.25 | smd 2.15 x 2.05: 25 0,0
USB-MICROB = smd 1.4 x 0.35: D+ -2.65,0; D- -2.65,-0.65; GND -2.65,1.3; ID -2.65,0.65; VBUS -2.65,-1.3 | smd 1.9 x 1.8: MT1 0,-4; MT2 0,4 | smd 1.9 x 1.9: P$1 0,-1.27; P$2 0,1.27
1X03 = drill 1.016 long: 1 -2.54,0; 2 0,0; 3 2.54,0
2X14 = drill 1.016 octagon: 1 -16.51,-1.27; 2 -16.51,1.27; 3 -13.97,-1.27; 4 -13.97,1.27; 5 -11.43,-1.27; 6 -11.43,1.27; 7 -8.89,-1.27; 8 -8.89,1.27; 9 -6.35,-1.27; 10 -6.35,1.27; 11 -3.81,-1.27; 12 -3.81,1.27; 13 -1.27,-1.27; 14 -1.27,1.27; 15 1.27,-1.27; 16 1.27,1.27; 17 3.81,-1.27; 18 3.81,1.27; 19 6.35,-1.27; 20 6.35,1.27; 21 8.89,-1.27; 22 8.89,1.27; 23 11.43,-1.27; 24 11.43,1.27; 25 13.97,-1.27; 26 13.97,1.27; 27 16.51,-1.27; 28 16.51,1.27
2X03 = drill 1.016 octagon: 1 -2.54,-1.27; 2 -2.54,1.27; 3 0,-1.27; 4 0,1.27; 5 2.54,-1.27; 6 2.54,1.27
L1812 = smd 1.9 x 3.4: 1 -1.95,0; 2 1.95,0
LPH-7366 = smd 0.75 x 4: 1 4,17; 2 3,17; 3 2,17; 4 1,17; 5 0,17; 6 -1,17; 7 -2,17; 8 -3,17; 9 -4,17 | hole 1.5: -17,13; 17,-12.5
1X02/90 = drill 1.016 long: 1 -1.27,-3.81; 2 1.27,-3.81
SOT363 = smd 0.42 x 0.6: 1 -0.65,-0.95; 2 0,-0.95; 3 0.65,-0.95; 4 0.65,0.95; 5 0,0.95; 6 -0.65,0.95
DTS-6 = drill 1 long: 1 -3.25,2.25; 2 3.25,2.25; 3 -3.25,-2.25; 4 3.25,-2.25
EDG-04 = drill 0.813 long: 1 -3.81,-3.81; 2 -1.27,-3.81; 3 1.27,-3.81; 4 3.81,-3.81; 5 3.81,3.81; 6 1.27,3.81; 7 -1.27,3.81; 8 -3.81,3.81
255SB = drill 1.118 long: 1 -3.81,0; 2 0,0; 3 3.81,0
693071010811 = smd 0.8 x 1.5: 1 0,0; 2 1.1,-0.4; 3 2.2,0; 4 3.3,0.2; 5 4.4,0; 6 5.5,0.2; 7 6.6,0; 8 7.7,0 | smd 1.4 x 1.9: 9 -4.66,3.85; 9-1 8.49,2.7 | smd 1.8 x 1.4: 10 1.2,-10.3; 10-1 6.89,-10.3
TQFP48 = smd 0.2 x 1: 1 -2.75,-4.5; 2 -2.25,-4.5; 3 -1.75,-4.5; 4 -1.25,-4.5; 5 -0.75,-4.5; 6 -0.25,-4.5; 7 0.25,-4.5; 8 0.75,-4.5; 9 1.25,-4.5; 10 1.75,-4.5; 11 2.25,-4.5; 12 2.75,-4.5; 25 2.75,4.5; 26 2.25,4.5; 27 1.75,4.5; 28 1.25,4.5; 29 0.75,4.5; 30 0.25,4.5; 31 -0.25,4.5; 32 -0.75,4.5; 33 -1.25,4.5; 34 -1.75,4.5; 35 -2.25,4.5; 36 -2.75,4.5 | smd 1 x 0.2: 13 4.5,-2.75; 14 4.5,-2.25; 15 4.5,-1.75; 16 4.5,-1.25; 17 4.5,-0.75; 18 4.5,-0.25; 19 4.5,0.25; 20 4.5,0.75; 21 4.5,1.25; 22 4.5,1.75; 23 4.5,2.25; 24 4.5,2.75; 37 -4.5,2.75; 38 -4.5,2.25; 39 -4.5,1.75; 40 -4.5,1.25; 41 -4.5,0.75; 42 -4.5,0.25; 43 -4.5,-0.25; 44 -4.5,-0.75; 45 -4.5,-1.25; 46 -4.5,-1.75; 47 -4.5,-2.25; 48 -4.5,-2.75
SOT23-8 = smd 0.42 x 0.835: 1 -1.905,-2.58; 2 -0.635,-2.58; 3 0.635,-2.58; 4 1.905,-2.58; 5 1.905,2.58; 6 0.635,2.58; 7 -0.635,2.58; 8 -1.905,2.58
SOT23-6' = smd 1.27 x 0.635: P$1 0,0; P$2 0,-1; P$3 0,-2; P$4 2.5,-2; P$5 2.5,-1; P$6 2.5,0
SSOP24 = smd 0.305 x 0.61: 1 -3.567,-3.72; 2 -2.917,-3.72; 3 -2.268,-3.72; 4 -1.617,-3.72; 5 -0.968,-3.72; 6 -0.318,-3.72; 7 0.333,-3.72; 8 0.983,-3.72; 9 1.633,-3.72; 10 2.283,-3.72; 11 2.933,-3.72; 12 3.583,-3.72; 13 3.583,3.9; 14 2.933,3.9; 15 2.283,3.9; 16 1.633,3.9; 17 0.983,3.9; 18 0.333,3.9; 19 -0.318,3.9; 20 -0.968,3.9; 21 -1.617,3.9; 22 -2.268,3.9; 23 -2.917,3.9; 24 -3.567,3.9
4 = drill 0.61 pad 1.27: A -1.27,1.27; C 1.27,-1.27; E 1.27,1.27; K -1.27,-1.27
3.2X2.5_KX-7 = smd 1.3 x 1.1: 1 -1.15,-0.9; 2 1.15,-0.9; 3 1.15,0.9; 4 -1.15,0.9

### Placement (x,y rotation side)
3.3V  -105.41,153.8 0 top  (outside the outline)
7.5K  -53.34,115.7 0 top  (outside the outline)
7.5K1  -46.99,115.7 0 top  (outside the outline)
_C1  22.01,51.5 270 bottom
_C2  24.97,51.49 270 bottom
_C3  28,70.5 0 bottom
_C4  38.99,65.5 90 bottom
_C5  28.99,53.5 270 bottom
_C6  33.99,53.49 270 bottom
_C7  31.61,53.44 270 bottom
_C8  22,59.5 270 bottom
_C9  -108,10.5 0 top  (outside the outline)
BATTERY  26.99,43.51 90 top
C6  -62.23,148.72 0 top  (outside the outline)
C7  -68.58,148.72 0 top  (outside the outline)
C8  -74.93,148.72 0 top  (outside the outline)
C9  -81.28,148.72 0 top  (outside the outline)
C12  -87.63,148.72 0 top  (outside the outline)
C13  -93.98,148.72 0 top  (outside the outline)
C14  -100.33,148.72 0 top  (outside the outline)
C17  -17.78,153.8 0 top  (outside the outline)
C18  -24.13,153.8 0 top  (outside the outline)
C19  -30.48,153.8 0 top  (outside the outline)
C20  -36.83,153.8 0 top  (outside the outline)
C21  -43.18,153.8 0 top  (outside the outline)
C22  -49.53,153.8 0 top  (outside the outline)
C23  -55.88,153.8 0 top  (outside the outline)
C24  -97.79,153.8 0 top  (outside the outline)
C25  -62.23,153.8 0 top  (outside the outline)
C26  -17.78,148.72 0 top  (outside the outline)
C27  -68.58,153.8 0 top  (outside the outline)
C28  -24.13,148.72 0 top  (outside the outline)
C29  -74.93,153.8 0 top  (outside the outline)
C30  -30.48,148.72 0 top  (outside the outline)
C31  -81.28,153.8 0 top  (outside the outline)
C32  -87.63,153.8 0 top  (outside the outline)
CELLS  13,33.5 0 top
D1  99.94,-10.7 180 top  (outside the outline)
D2  -69.14,69.22 0 top  (outside the outline)
D3  -17.78,97.92 0 top  (outside the outline)
D4  -27.94,97.92 0 top  (outside the outline)
D5  -38.1,97.92 0 top  (outside the outline)
D6  -48.26,97.92 0 top  (outside the outline)
D7  -58.42,97.92 0 top  (outside the outline)
D8  100.37,-2.7 180 top  (outside the outline)
DIS1  15,76.5 180 bottom
DIS2  75.03,76.5 0 bottom
DIS3  3,64.54 90 bottom
DIS4  55.13,74.45 315 bottom
DIS5  34.87,74.48 45 bottom
DIS6  87,64.5 90 bottom
DIS7  -53.34,142.37 0 top  (outside the outline)
IC1  89.96,-11.52 0 top  (outside the outline)
IC2  90,2.52 0 top
IC3  89.99,-4.52 0 top  (outside the outline)
IC4  101.9,75.47 90 bottom  (outside the outline)
J1  -95.25,85.22 0 top  (outside the outline)
JP1  -74.93,142.37 0 top  (outside the outline)
JP2  -22,25.5 0 top  (outside the outline)
JP4  81.69,64.44 90 top
JP11  -83.82,142.37 0 top  (outside the outline)
JP12  -92.71,142.37 0 top  (outside the outline)
JP13  -104,35.5 0 top  (outside the outline)
JP14  -104,29.5 0 top  (outside the outline)
L1  104.69,1.82 90 top  (outside the outline)
L2  105.53,-9.01 90 top  (outside the outline)
LCD1  -33.02,58.55 0 top  (outside the outline)
LED1  -60.96,136.02 0 top  (outside the outline)
MA  41.99,18.51 180 bottom
MB  48,18.5 180 bottom
Q2  94.01,-11.52 0 top  (outside the outline)
Q3  94.01,2.51 0 top  (outside the outline)
Q4  94,-4.48 0 top  (outside the outline)
R1  -26.67,137.29 0 top  (outside the outline)
R2  -31.75,137.29 0 top  (outside the outline)
R3  -36.83,137.29 0 top  (outside the outline)
R4  -21.59,137.29 0 top  (outside the outline)
R7  -41.91,137.29 0 top  (outside the outline)
R8  -46.99,137.29 0 top  (outside the outline)
R10  -72.39,115.7 0 top  (outside the outline)
R11  -16.51,137.29 0 top  (outside the outline)
R12  -78.74,115.7 0 top  (outside the outline)
R13  -85.09,115.7 0 top  (outside the outline)
R14  -91.44,115.7 0 top  (outside the outline)
R15  -59.69,115.7 0 top  (outside the outline)
R16  -97.79,115.7 0 top  (outside the outline)
R17  -104.14,115.7 0 top  (outside the outline)
R18  -16.51,124.59 0 top  (outside the outline)
R19  -22.86,124.59 0 top  (outside the outline)
R20  -29.21,124.59 0 top  (outside the outline)
R21  -35.56,124.59 0 top  (outside the outline)
R22  -41.91,124.59 0 top  (outside the outline)
R23  -48.26,124.59 0 top  (outside the outline)
R24  -54.61,124.59 0 top  (outside the outline)
R25  -60.96,124.59 0 top  (outside the outline)
R26  -67.31,124.59 0 top  (outside the outline)
R27  -73.66,124.59 0 top  (outside the outline)
R28  -80.01,124.59 0 top  (outside the outline)
R29  -86.36,124.59 0 top  (outside the outline)
R30  -92.71,124.59 0 top  (outside the outline)
R31  -99.06,124.59 0 top  (outside the outline)
R32  -105.41,124.59 0 top  (outside the outline)
R33  -16.51,130.94 0 top  (outside the outline)
R34  -22.86,130.94 0 top  (outside the outline)
R35  -29.21,130.94 0 top  (outside the outline)
R36  -35.56,130.94 0 top  (outside the outline)
R37  -41.91,130.94 0 top  (outside the outline)
R38  -48.26,130.94 0 top  (outside the outline)
R39  -54.61,130.94 0 top  (outside the outline)
R40  -60.96,130.94 0 top  (outside the outline)
R41  -67.31,130.94 0 top  (outside the outline)
R42  -73.66,130.94 0 top  (outside the outline)
R43  -80.01,130.94 0 top  (outside the outline)
R44  -86.36,130.94 0 top  (outside the outline)
R45  -92.71,130.94 0 top  (outside the outline)
R46  -99.06,130.94 0 top  (outside the outline)
R47  -66.04,115.7 0 top  (outside the outline)
R48  -105.41,130.94 0 top  (outside the outline)
RESET  -76.2,85.22 0 top  (outside the outline)
S2  -29.21,85.22 0 top  (outside the outline)
S4  -19.05,106.81 0 top  (outside the outline)
SD_CARD  -73.66,50.93 0 top  (outside the outline)
START  -86.36,85.22 0 top  (outside the outline)
STM32  31,62.51 45 bottom
SWD  -105.41,142.37 0 top  (outside the outline)
SWD_CON  72.77,72.63 180 top
U$1  83.99,-11.48 0 top  (outside the outline)
U$2  83.98,2.5 0 top
U$3  84,-4.5 0 top
U$4  MT3608SOT23-6  [SOT23-6']  98.99,-8.49 90 top  (outside the outline)
U$5  MT3608SOT23-6  [SOT23-6']  99,0.5 90 top  (outside the outline)
U$6  48,54.5 270 bottom
U$7  64,54.51 270 bottom
U$8  45,4 0 top
U$9  -49.53,85.22 0 top  (outside the outline)
U$10  85.99,75.49 0 bottom
U$11  3.99,75.49 0 bottom
USB  -13.97,158.88 0 top  (outside the outline)
XTAL  23.6,54.8 0 bottom

### Tracks (layer width: path | path; a pad name or v marks a point on that pad's centre or on a via)
A01  (3 unrouted)
  Top 1.5: MA.1 40.73,41.23 44,44.5
  Bottom 0.152: U$6.1 51.72,57.5 U$6.2
ADC1  (2 unrouted)
ADC2  (2 unrouted)
ADC3  (2 unrouted)
ADC4  (2 unrouted)
ADC5  (1 unrouted)
ADC6  (1 unrouted)
AO2  (4 unrouted)
  Top 1.5: MA.2 43.27,38.77 53,48.5
B01  (2 unrouted)
  Top 1.5: MB.1 46.73,38.23 56,47.5
  Bottom 0.152: U$7.1 U$7.2 | U$7.11 U$7.12
B02  (4 unrouted)
  Top 1.5: MB.2 49.27,37.43 58.17,46.33
BAT  (2 unrouted)
BAT+  (2 unrouted)
BAT_ON  (via drill 1)  (18 unrouted)
  Bottom 1.5: U$6.13 44.1,50.4 v45,49.5
BOOT0
  Bottom 0.2: STM32.44 32,60.45 32,61.5 33,62.5 78.48,62.5 JP4.4
BOOT1  (1 unrouted)
BUT  (3 unrouted)
  Bottom 0.2: STM32.3 27,56.04 27,50.5
CELL1  (2 unrouted)
CELL2  (2 unrouted)
CELL3  (2 unrouted)
CS  (2 unrouted)
D+  (3 unrouted)
D-  (1 unrouted)
GND  (101 unrouted)
  Bottom 0.2: STM32.23 29.41,68.24 _C3.2 | STM32.35 38.02,66.35 _C4.2 | _C1.2 _C2.2 | _C8.2 26.08,58.65 STM32.8 | 32.15,52.65 _C5.2 | STM32.47 36,54.33 36,53.5 35.14,52.64 _C6.2 | _C6.2 | _C7.2 33.95,52.59 _C6.2 | U$7.3 U$7.4
  Bottom 0.3: U$7.3 68.72,56.77 69,56.5 68.62,56.12 U$7.4 | U$7.9 68.62,52.88 69,52.5 68.72,52.23 U$7.10
  Bottom 1: 45.4,46.5 47,48.1 47,57.5
  Bottom 2: BATTERY.1 41.14,42.24 45.4,46.5
INT  (1 unrouted)
LED1  (1 unrouted)
  Bottom 0.2: STM32.2 28,56.33 28,50.5
MA1  (via drill 1)
  Top 0.2: v42,59.5 41,58.5 v41,54.5
  Bottom 0.2: U$6.17 44.08,53.5 42,53.5 v41,54.5 42.62,56.12 U$6.21 | STM32.41 35.07,59.5 v42,59.5
MA2
  Bottom 0.2: STM32.45 34.97,56.77 | 34.97,56.77 U$6.22 | U$6.16 39.87,52.87 34.97,56.77
MB1  (2 unrouted)
MB2  (2 unrouted)
MISO  (2 unrouted)
MOSI  (3 unrouted)
N$1  (1 unrouted)
N$3
  Bottom 0.2: XTAL.1 24.97,53.68 | 24.97,53.68 _C2.1 | STM32.5 26,56.45 26,54.71 24.97,53.68
N$4
  Bottom 0.2: _C1.1 21,53.35 21,54.5 22.2,55.7 | 22.2,55.7 XTAL.3 | STM32.6 25.67,56.83 23.33,56.83 22.2,55.7
N$6  (1 unrouted)
N$7  (1 unrouted)
N$8  (1 unrouted)
N$9  (1 unrouted)
N$10  (1 unrouted)
N$11  (1 unrouted)
N$12  (1 unrouted)
N$13  (1 unrouted)
N$14  (1 unrouted)
N$15  (1 unrouted)
N$16  (1 unrouted)
N$18  (1 unrouted)
N$19  (1 unrouted)
N$20  (1 unrouted)
N$22  (1 unrouted)
N$23  (1 unrouted)
N$24  (1 unrouted)
N$25  (1 unrouted)
N$26  (1 unrouted)
N$27  (1 unrouted)
N$28  (1 unrouted)
N$29  (2 unrouted)
N$30  (1 unrouted)
N$31  (1 unrouted)
N$32  (1 unrouted)
N$33  (2 unrouted)
N$34  (1 unrouted)
N$35  (1 unrouted)
N$36  (1 unrouted)
N$37  (1 unrouted)
N$38  (2 unrouted)
N$39  (1 unrouted)
N$40  (1 unrouted)
N$41  (1 unrouted)
N$42  (1 unrouted)
N$45  (1 unrouted)
N$46
  Bottom 1: 51.68,52.55 50.95,52.55 50,53.5 50,55.5 50.96,56.46 51.72,56.46
N$47  (2 unrouted)
N$48
  Bottom 1: 51.7,57.8 50.12,57.8 48.71,56.39 48.71,52.63 50.12,51.23 51.48,51.23
N$49  (2 unrouted)
N$50  (2 unrouted)
N$51  (2 unrouted)
N$54  (1 unrouted)
N$55  (1 unrouted)
N$56  (1 unrouted)
N$60
  Bottom 1: 67.7,57.8 66.12,57.8 64.71,56.39 64.71,52.63 66.12,51.23 67.48,51.23
N$61  (1 unrouted)
N$62  (1 unrouted)
N$63  (1 unrouted)
N$65  (1 unrouted)
N$66  (1 unrouted)
N$68  (1 unrouted)
NRST  (4 unrouted)
PWMA  (via drill 1)
  Top 0.2: v40,50.5 v40,58.5
  Bottom 0.2: STM32.46 37.27,53.77 | 39.54,50.5 v40,50.5 39,50.5 37.27,52.23 37.27,53.77 | U$6.23 41.08,57.42 v40,58.5 | 37.27,53.77 38.81,52.22 U$6.15
PWMB  (2 unrouted)
SCK  (1 unrouted)
SCL1  (2 unrouted)
SCL2  (9 unrouted)
SDA1  (2 unrouted)
SDA2  (9 unrouted)
SWCLK  (1 unrouted)
SWDA  (1 unrouted)
  Bottom 0.2: STM32.34 38.46,67.5
VBUS  (1 unrouted)
VCC  (25 unrouted)
  Bottom 0.2: U$6.19 U$6.20 44.12,55.5 45,55.5 46,56.5 46,57.5
  pour Bottom: 43.89,55.52 43.89,54.77 44.3,54.77 44.3,55.52
VDD  (34 unrouted)
  Bottom 0.2: STM32.24 29.76,69.59 _C3.1 | STM32.36 37.03,64.65 _C4.1 | STM32.1 29,56.62 29,54.36 _C5.1 31.85,54.35 | STM32.9 26.22,59.5 24,59.5 23,60.5 22.15,60.5 _C8.1 | _C7.1 33.94,54.29 _C6.1 33.99,55.63 STM32.48
VUSB  (15 unrouted)
(copper drawn outside any net)
  shapes: Bottom area x8